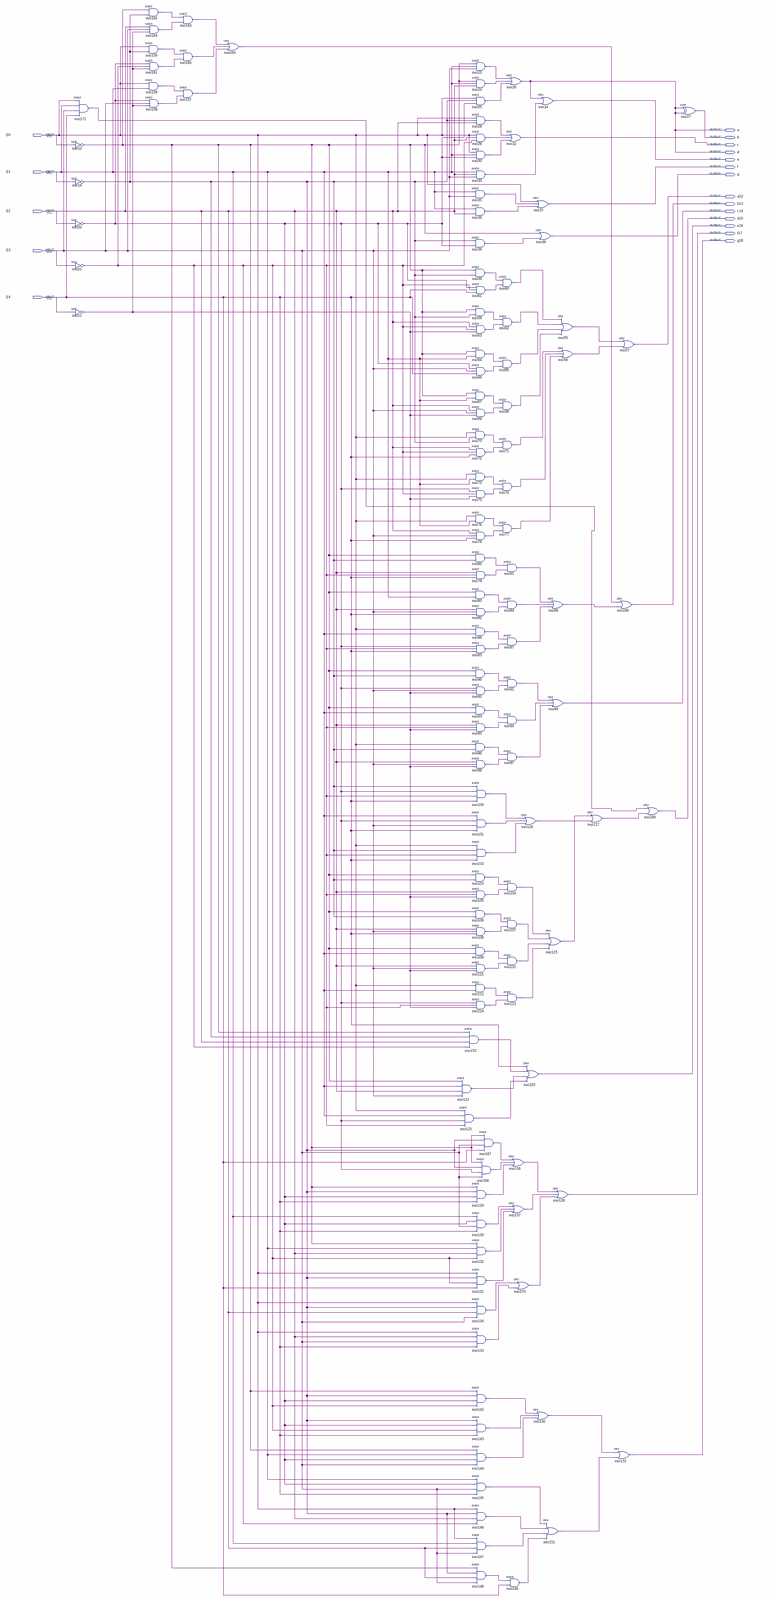
[diagram p0: schematic sheet, whole]
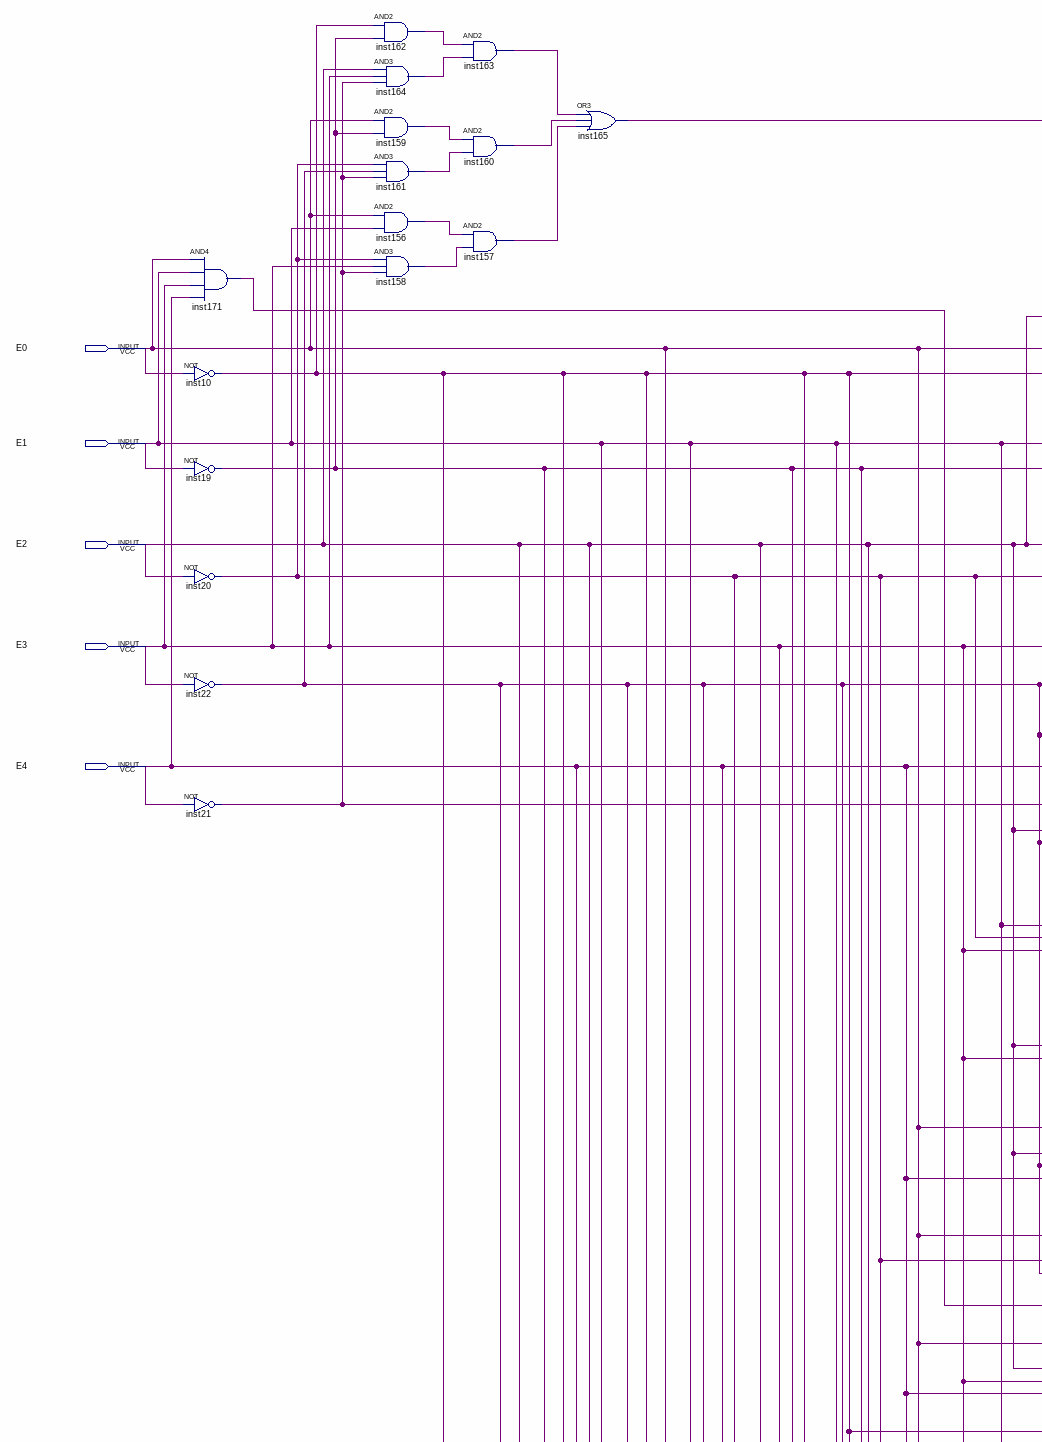
[diagram p1: schematic sheet, upper left part]
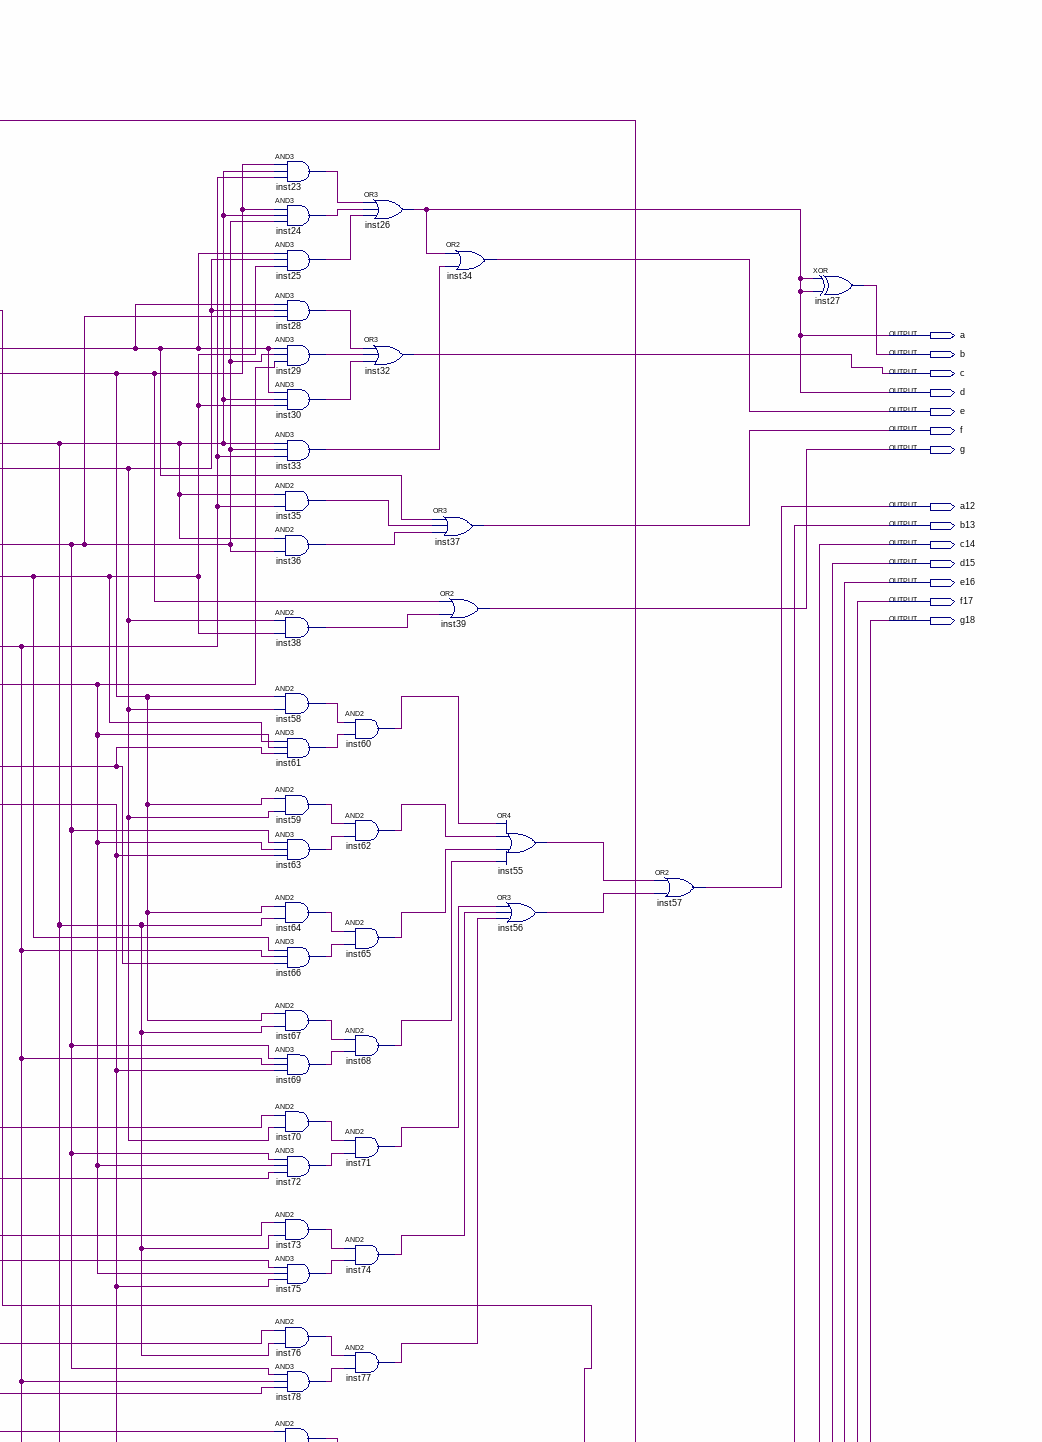
[diagram p2: schematic sheet, upper right part]
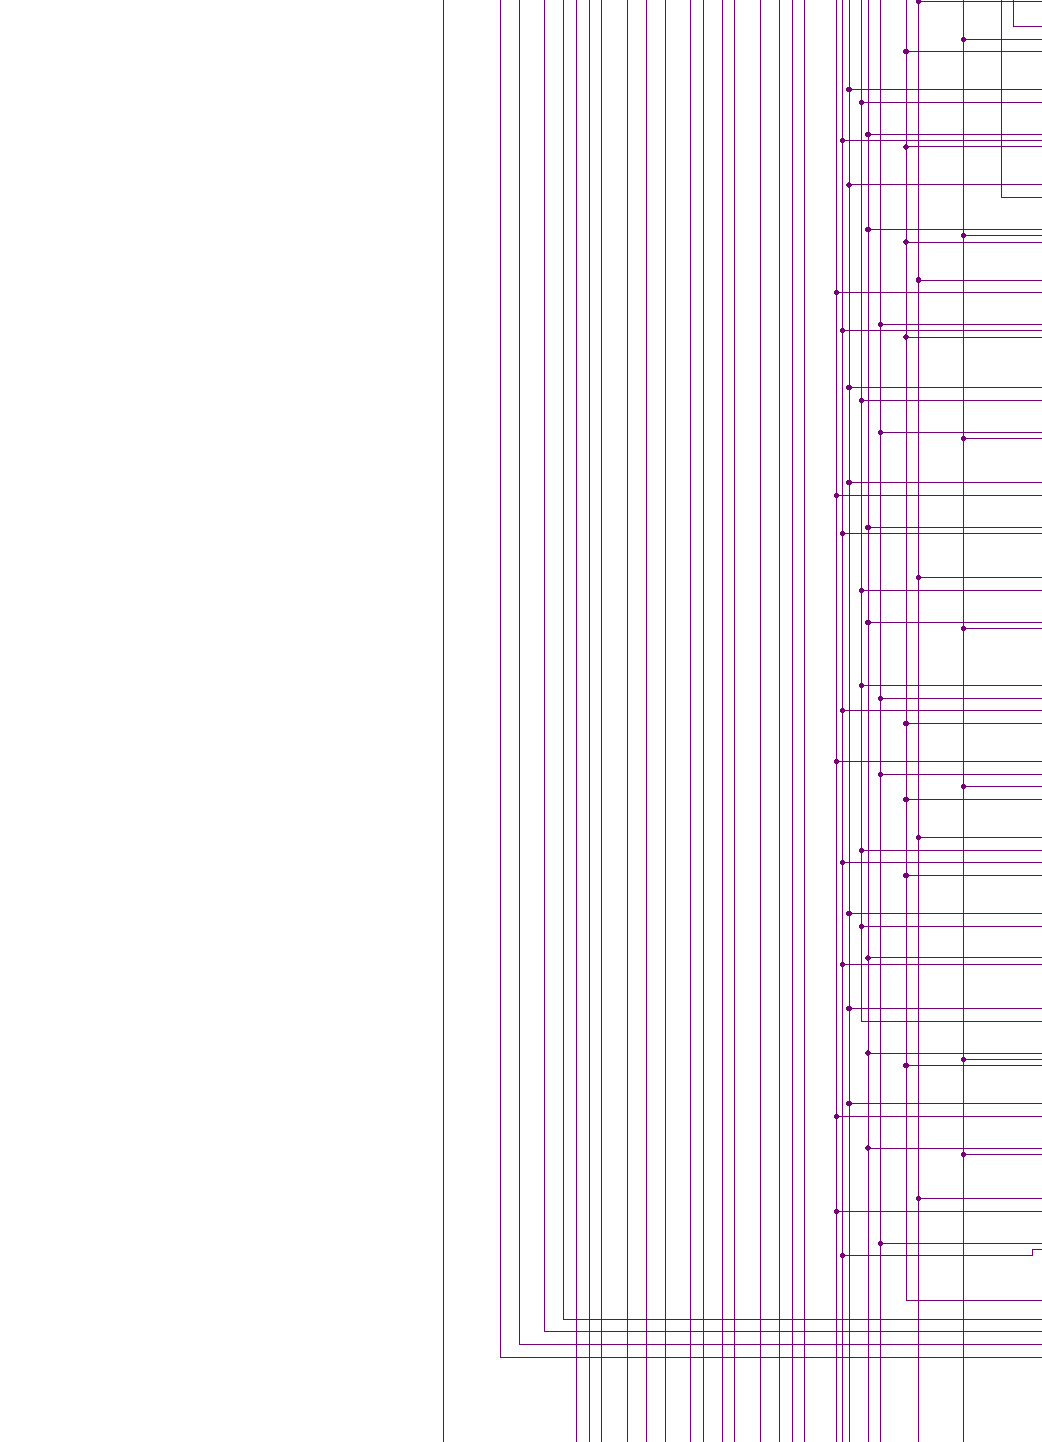
[diagram p3: schematic sheet, middle left part]
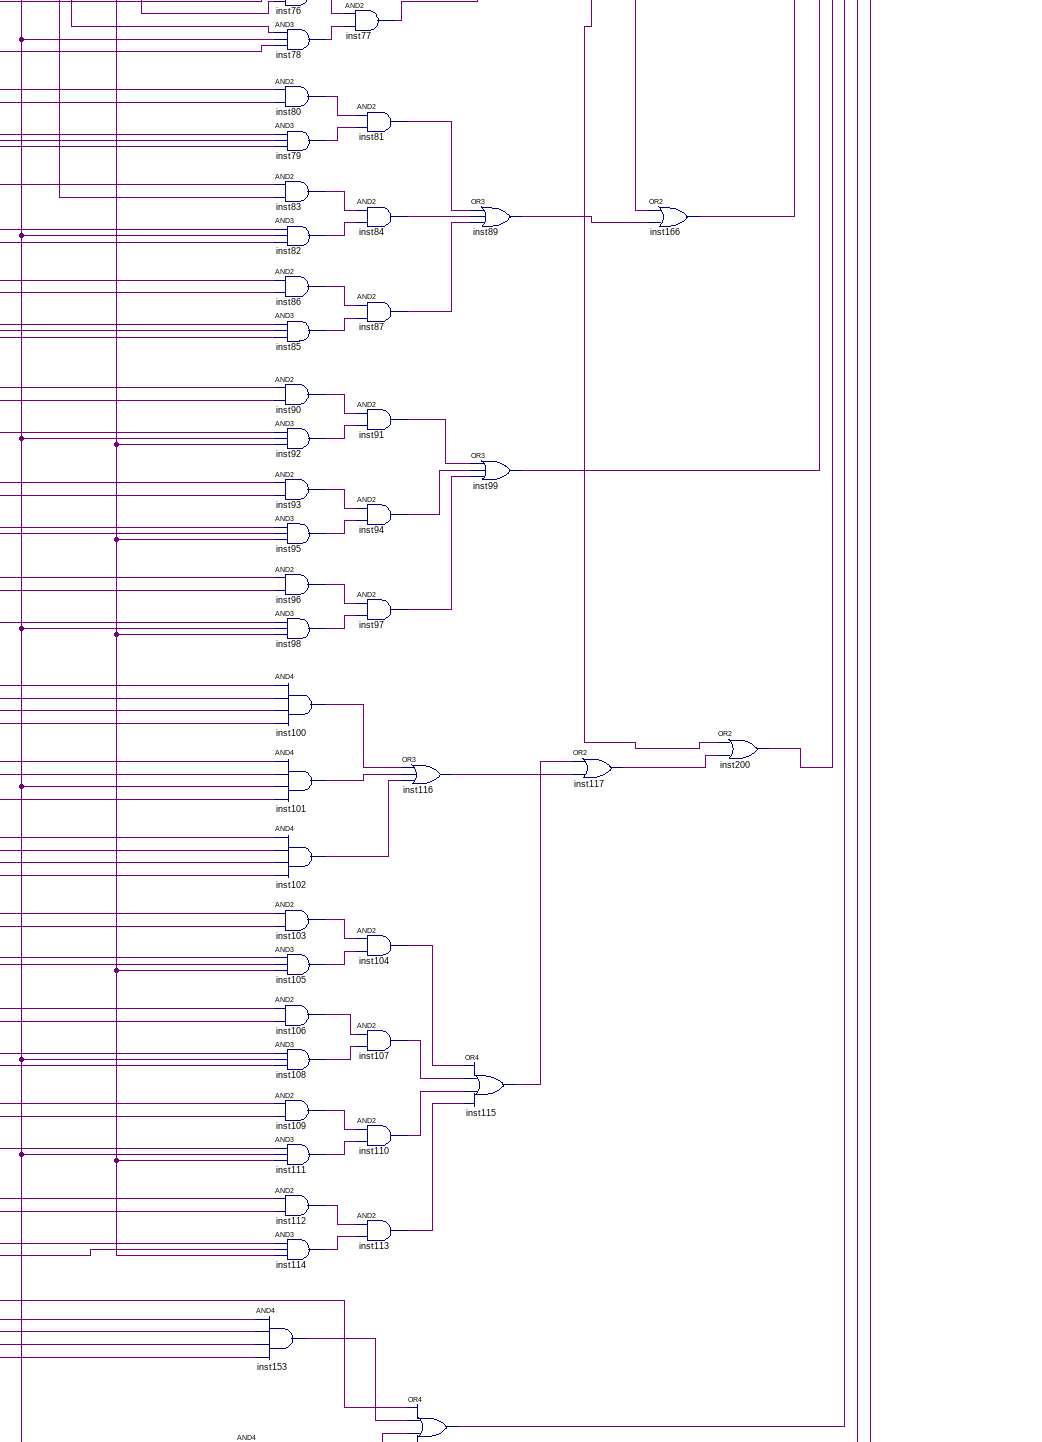
[diagram p4: schematic sheet, middle right part]
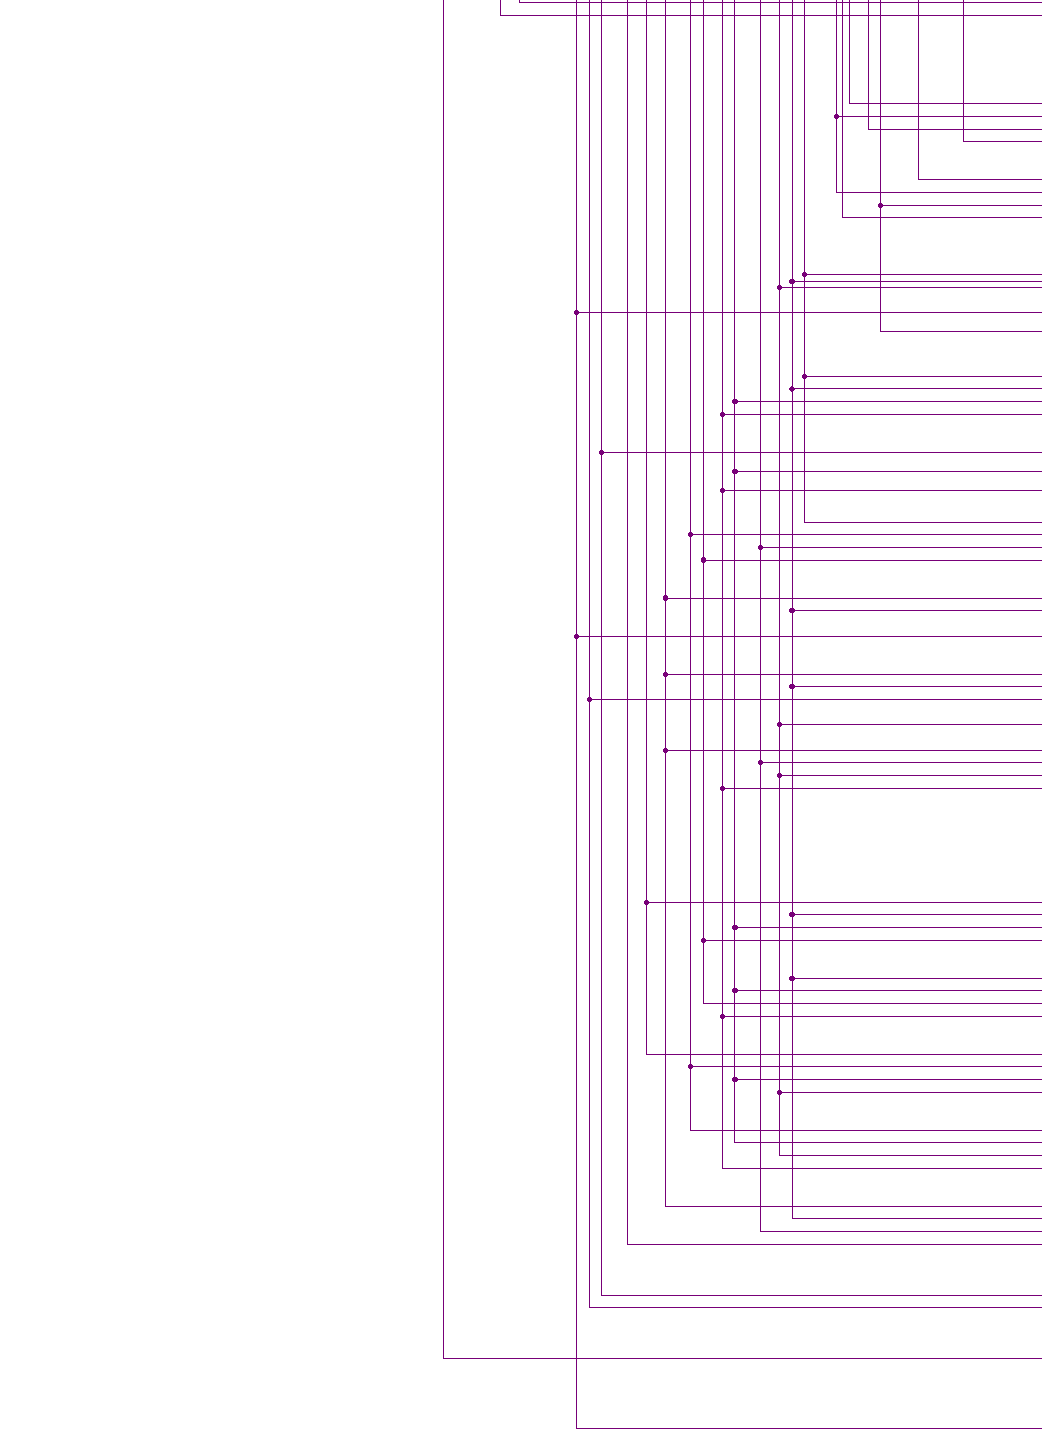
[diagram p5: schematic sheet, lower left part]
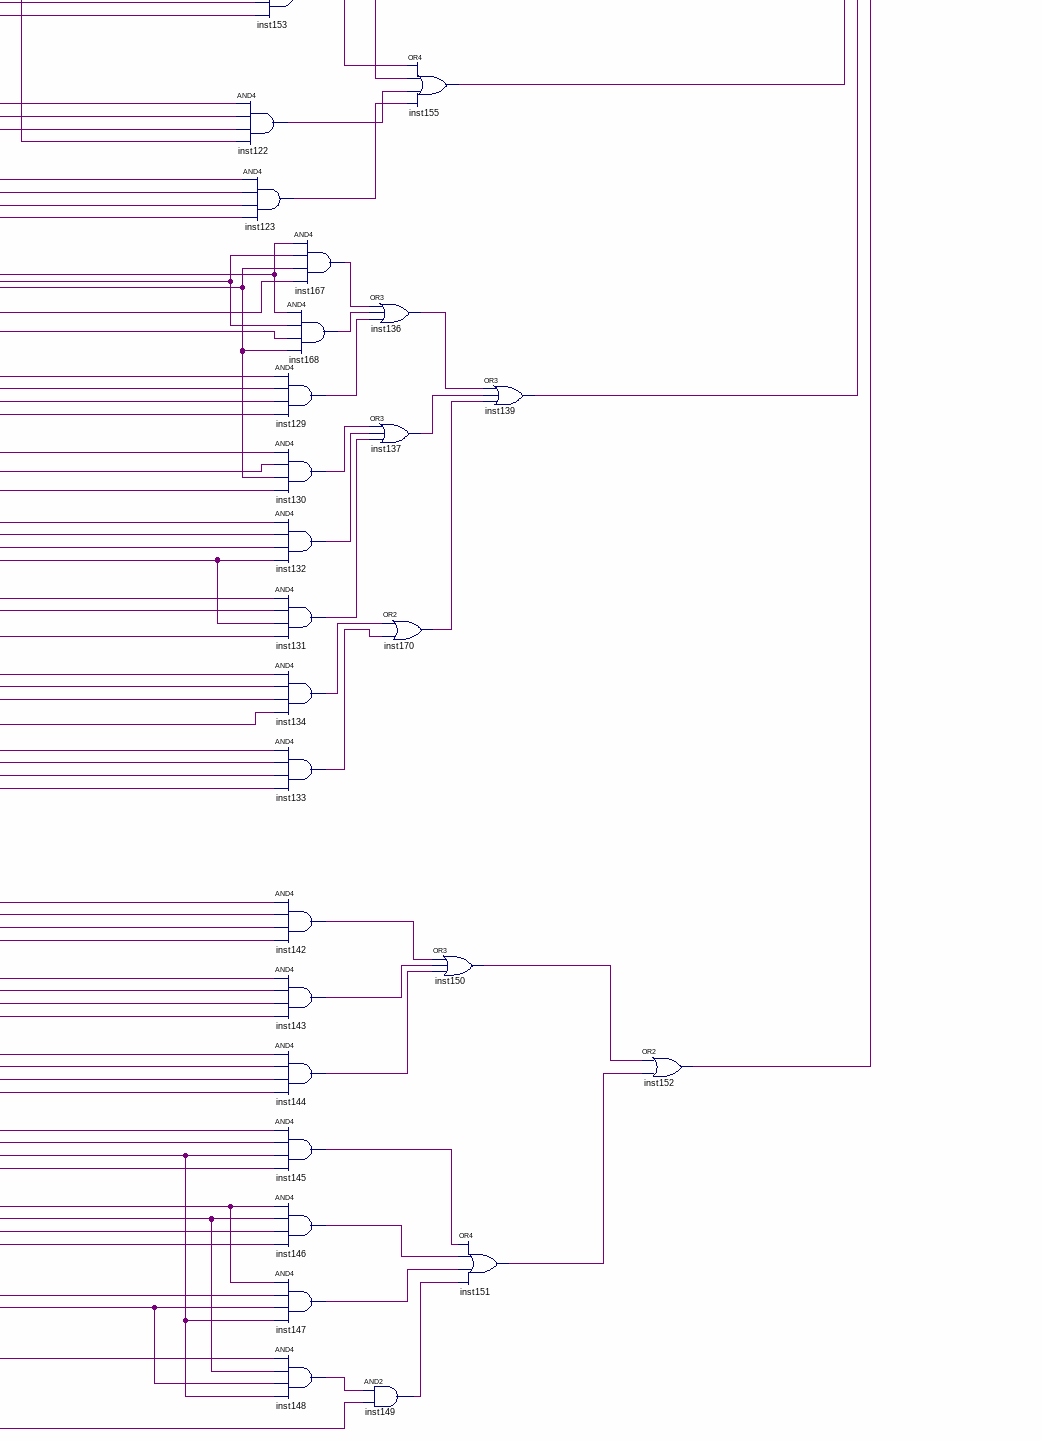
[diagram p6: schematic sheet, lower right part]
// Quartus schematic sdDecOut.bdf as structural Verilog: 123 symbols, 19 pins
module sdDecOut (
  input  E0,
  input  E1,
  input  E2,
  input  E3,
  input  E4,
  output a,
  output b,
  output c,
  output d,
  output e,
  output f,
  output g,
  output a12,
  output b13,
  output c14,
  output d15,
  output e16,
  output f17,
  output g18
);

  wire inst10_out, inst19_out, inst20_out, inst21_out, inst22_out, inst23_out, inst24_out, inst25_out,
       inst28_out, inst29_out, inst30_out, inst33_out, inst35_out, inst36_out, inst38_out, inst55_out,
       inst56_out, inst58_out, inst59_out, inst60_out, inst61_out, inst62_out, inst63_out, inst64_out,
       inst65_out, inst66_out, inst67_out, inst68_out, inst69_out, inst70_out, inst71_out, inst72_out,
       inst73_out, inst74_out, inst75_out, inst76_out, inst77_out, inst78_out, inst79_out, inst80_out,
       inst81_out, inst82_out, inst83_out, inst84_out, inst85_out, inst86_out, inst87_out, inst89_out,
       inst90_out, inst91_out, inst92_out, inst93_out, inst94_out, inst95_out, inst96_out, inst97_out,
       inst98_out, inst100_out, inst101_out, inst102_out, inst103_out, inst104_out, inst105_out, inst106_out,
       inst107_out, inst108_out, inst109_out, inst110_out, inst111_out, inst112_out, inst113_out,
       inst114_out, inst115_out, inst116_out, inst117_out, inst122_out, inst123_out, inst129_out,
       inst130_out, inst131_out, inst132_out, inst133_out, inst134_out, inst136_out, inst137_out,
       inst142_out, inst143_out, inst144_out, inst145_out, inst146_out, inst147_out, inst148_out,
       inst149_out, inst150_out, inst151_out, inst153_out, inst156_out, inst157_out, inst158_out,
       inst159_out, inst160_out, inst161_out, inst162_out, inst163_out, inst164_out, inst165_out,
       inst167_out, inst168_out, inst170_out, inst171_out;

  and inst171 (inst171_out, E0, E1, E3, E4);
  not inst10 (inst10_out, E0);
  not inst19 (inst19_out, E1);
  not inst20 (inst20_out, E2);
  not inst22 (inst22_out, E3);
  not inst21 (inst21_out, E4);
  and inst162 (inst162_out, inst10_out, inst19_out);
  and inst164 (inst164_out, E2, E3, inst21_out);
  and inst159 (inst159_out, E0, inst19_out);
  and inst161 (inst161_out, inst20_out, inst22_out, inst21_out);
  and inst156 (inst156_out, E0, E1);
  and inst158 (inst158_out, inst20_out, E3, inst21_out);
  and inst163 (inst163_out, inst162_out, inst164_out);
  and inst160 (inst160_out, inst159_out, inst161_out);
  and inst157 (inst157_out, inst156_out, inst158_out);
  or inst165 (inst165_out, inst163_out, inst160_out, inst157_out);
  and inst122 (inst122_out, inst10_out, E1, E2, E3);
  and inst123 (inst123_out, E0, E1, inst20_out, inst22_out);
  and inst23 (inst23_out, inst10_out, E1, E3);
  and inst24 (inst24_out, inst10_out, E1, E2);
  and inst25 (inst25_out, E0, inst19_out, inst20_out);
  and inst28 (inst28_out, E0, inst19_out, E2);
  and inst29 (inst29_out, E0, E2, inst22_out);
  and inst30 (inst30_out, E0, E1, inst20_out);
  and inst33 (inst33_out, E1, E2, E3);
  and inst35 (inst35_out, E1, E3);
  and inst36 (inst36_out, E1, E2);
  and inst38 (inst38_out, inst19_out, inst20_out);
  and inst58 (inst58_out, inst10_out, inst19_out);
  and inst61 (inst61_out, inst20_out, inst22_out, E4);
  and inst59 (inst59_out, inst10_out, inst19_out);
  and inst63 (inst63_out, E2, inst22_out, inst21_out);
  and inst64 (inst64_out, inst10_out, E1);
  and inst66 (inst66_out, inst20_out, E3, E4);
  and inst67 (inst67_out, inst10_out, E1);
  and inst69 (inst69_out, E2, E3, inst21_out);
  and inst70 (inst70_out, E0, inst19_out);
  and inst72 (inst72_out, E2, inst22_out, E4);
  and inst73 (inst73_out, E0, E1);
  and inst75 (inst75_out, inst20_out, inst22_out, inst21_out);
  and inst76 (inst76_out, E0, E1);
  and inst78 (inst78_out, E2, E3, E4);
  and inst80 (inst80_out, inst10_out, inst19_out);
  and inst79 (inst79_out, E2, inst22_out, E4);
  and inst83 (inst83_out, inst10_out, E1);
  and inst82 (inst82_out, E2, E3, E4);
  and inst86 (inst86_out, E0, E1);
  and inst85 (inst85_out, inst20_out, inst22_out, E4);
  and inst90 (inst90_out, inst10_out, inst19_out);
  and inst92 (inst92_out, inst20_out, E3, inst21_out);
  and inst93 (inst93_out, inst10_out, E1);
  and inst95 (inst95_out, E2, inst22_out, inst21_out);
  and inst96 (inst96_out, E0, inst19_out);
  and inst98 (inst98_out, E2, E3, inst21_out);
  and inst100 (inst100_out, inst19_out, inst20_out, inst22_out, E4);
  and inst101 (inst101_out, E1, inst20_out, E3, E4);
  and inst102 (inst102_out, E0, inst19_out, inst22_out, E4);
  and inst103 (inst103_out, inst10_out, inst19_out);
  and inst105 (inst105_out, E2, inst22_out, inst21_out);
  and inst106 (inst106_out, inst10_out, inst19_out);
  and inst108 (inst108_out, E2, E3, E4);
  and inst109 (inst109_out, inst10_out, E1);
  and inst111 (inst111_out, E2, E3, inst21_out);
  and inst112 (inst112_out, E0, E1);
  and inst114 (inst114_out, inst20_out, inst22_out, inst21_out);
  and inst153 (inst153_out, inst10_out, inst19_out, E2, inst22_out);
  and inst167 (inst167_out, inst10_out, inst19_out, E3, E4);
  and inst168 (inst168_out, inst10_out, inst19_out, inst20_out, E3);
  and inst129 (inst129_out, inst10_out, inst19_out, inst20_out, E4);
  and inst130 (inst130_out, E1, inst20_out, E3, E4);
  and inst132 (inst132_out, inst10_out, E1, E2, inst22_out);
  and inst131 (inst131_out, E0, inst19_out, inst22_out, E4);
  and inst134 (inst134_out, E0, inst19_out, E2, E3);
  and inst133 (inst133_out, E0, E2, E3, E4);
  and inst142 (inst142_out, inst10_out, inst19_out, inst20_out, inst22_out);
  and inst143 (inst143_out, inst19_out, inst20_out, inst22_out, E4);
  and inst144 (inst144_out, inst10_out, E1, inst20_out, E3);
  and inst145 (inst145_out, E1, inst20_out, E3, E4);
  and inst146 (inst146_out, E0, inst19_out, E2, inst22_out);
  and inst147 (inst147_out, E0, E1, E2, E3);
  and inst148 (inst148_out, inst10_out, inst19_out, E2, E3);
  and inst60 (inst60_out, inst58_out, inst61_out);
  and inst62 (inst62_out, inst59_out, inst63_out);
  and inst65 (inst65_out, inst64_out, inst66_out);
  and inst68 (inst68_out, inst67_out, inst69_out);
  and inst71 (inst71_out, inst70_out, inst72_out);
  and inst74 (inst74_out, inst73_out, inst75_out);
  and inst77 (inst77_out, inst76_out, inst78_out);
  or inst26 (a, inst23_out, inst24_out, inst25_out);
  or inst32 (c, inst28_out, inst29_out, inst30_out);
  and inst81 (inst81_out, inst80_out, inst79_out);
  and inst84 (inst84_out, inst83_out, inst82_out);
  and inst87 (inst87_out, inst86_out, inst85_out);
  and inst91 (inst91_out, inst90_out, inst92_out);
  and inst94 (inst94_out, inst93_out, inst95_out);
  and inst97 (inst97_out, inst96_out, inst98_out);
  and inst104 (inst104_out, inst103_out, inst105_out);
  and inst107 (inst107_out, inst106_out, inst108_out);
  and inst110 (inst110_out, inst109_out, inst111_out);
  and inst113 (inst113_out, inst112_out, inst114_out);
  or inst136 (inst136_out, inst167_out, inst168_out, inst129_out);
  or inst137 (inst137_out, inst130_out, inst132_out, inst131_out);
  or inst170 (inst170_out, inst134_out, inst133_out);
  and inst149 (inst149_out, inst148_out, E4);
  or inst34 (e, a, inst33_out);
  or inst37 (f, E0, inst35_out, inst36_out);
  or inst39 (g, inst10_out, inst38_out);
  or inst116 (inst116_out, inst100_out, inst101_out, inst102_out);
  or inst155 (e16, E4, inst153_out, inst122_out, inst123_out);
  or inst150 (inst150_out, inst142_out, inst143_out, inst144_out);
  or inst55 (inst55_out, inst60_out, inst62_out, inst65_out, inst68_out);
  or inst56 (inst56_out, inst71_out, inst74_out, inst77_out);
  or inst89 (inst89_out, inst81_out, inst84_out, inst87_out);
  or inst99 (c14, inst91_out, inst94_out, inst97_out);
  or inst115 (inst115_out, inst104_out, inst107_out, inst110_out, inst113_out);
  or inst139 (f17, inst136_out, inst137_out, inst170_out);
  or inst151 (inst151_out, inst145_out, inst146_out, inst147_out, inst149_out);
  or inst117 (inst117_out, inst115_out, inst116_out);
  or inst166 (b13, inst165_out, inst89_out);
  or inst152 (g18, inst150_out, inst151_out);
  or inst57 (a12, inst55_out, inst56_out);
  or inst200 (d15, inst171_out, inst117_out);
  xor inst27 (b, a, a);

  assign d = a;
endmodule
